# EAGLE schematic 7segement4digits1badidea-mk-1 (EAGLE 6.5.0)
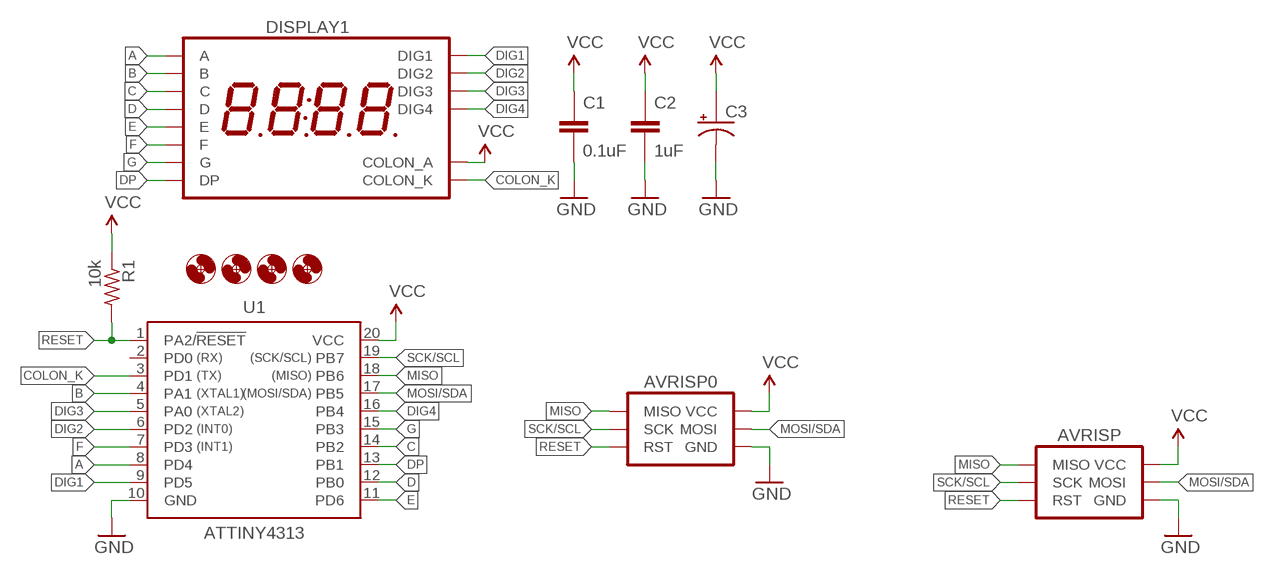
[diagram p0: schematic, sheet 1]

## Parts
AVRISP  AVR_SPI_PRG_6PTH  [2X3]
AVRISP0  AVR_SPI_PRG_6AVR-JST-PTH-RA-I2C  [AVR-JST-6-PTH-RA-I2C]
C1  0.1uF  CAPACITOR-CERAMIC025-024X044  [C025-024X044]
C2  1uF  CAPACITOR-CERAMIC025-024X044  [C025-024X044]
C3  CAPACITOR-POLARIZEDE2-4  [E2-4]
DISPLAY1  7SED_4DIGIT_14MM14.2MM-CC  [7SEG_4DIG]
H1  HOLE#2  [HOLE-#2]
H2  HOLE#2  [HOLE-#2]
H3  HOLE#2  [HOLE-#2]
H4  HOLE#2  [HOLE-#2]
R1  10k  RESISTORPTH-AXIAL-7.68MM  [RESISTOR-AXIAL-PTH-7.68MM]
U1  ATTINY4313  ATTINY2313ADIP  [DIL20]

## Nets
A: DISPLAY1.P$13(A) U1.8(PD4)
B: DISPLAY1.P$9(B) U1.4(PA1)
C: DISPLAY1.P$4(C) U1.14(PB2)
COLON_K: DISPLAY1.P$7(COLON_K) U1.3(PD1)
D: DISPLAY1.P$2(D) U1.12(PB0)
DIG1: DISPLAY1.P$14(DIG1) U1.9(PD5)
DIG2: DISPLAY1.P$11(DIG2) U1.6(PD2)
DIG3: DISPLAY1.P$10(DIG3) U1.5(PA0)
DIG4: DISPLAY1.P$6(DIG4) U1.16(PB4)
DP: DISPLAY1.P$3(DP) U1.13(PB1)
E: DISPLAY1.P$1(E) U1.11(PD6)
F: DISPLAY1.P$12(F) U1.7(PD3)
G: DISPLAY1.P$5(G) U1.15(PB3)
GND: AVRISP0.GND AVRISP.6(GND) C1.2 C2.2 C3.- U1.10(GND)
MISO: AVRISP0.MISO AVRISP.1(MISO) U1.18(PB6)
MOSI/SDA: AVRISP0.MOSI/SDA(MOSI) AVRISP.4(MOSI) U1.17(PB5)
RESET: AVRISP0.RESET(RST) AVRISP.5(RST) R1.P$2 U1.1(PA2/!RESET)
SCK/SCL: AVRISP0.SCK AVRISP.3(SCK) U1.19(PB7)
VCC: AVRISP0.VCC AVRISP.2(VCC) C1.1 C2.1 C3.+ DISPLAY1.P$8(COLON_A) R1.P$1 U1.20(VCC)
Unconnected: U1.2(PD0)

## Library data of the parts
AVRISP AVRISP0 = A_butts:AVR_SPI_PRG_6: AVR ISP 6 Pin This is the reduced ISP connector for AVR programming. Common on Arduino. This footprint will take up less PCB space and can be used with a 10-pin to 6-pin adapter such as SKU: BOB-08508 **Special note about "TEST_POINT" package. The stop mask is on the top side, so if you want your programming test points to be on the bottom of your board, make sure to place this package on the bottom side of the board. This also ensure that the orientation to program from the bottom side will be correct.
C1 C2 = A_butts:CAPACITOR-CERAMIC: CAPACITOR, European symbol
C3 = A_butts:CAPACITOR-POLARIZED: POLARIZED CAPACITOR, American symbol
DISPLAY1 = A_butts:7SED_4DIGIT_14MM
H1-H4 = A_butts:HOLE: MOUNTING HOLE with drill center marker
R1 = A_butts:RESISTOR: RESISTOR, American symbol
U1 = A_butts:ATTINY2313A: ATTINY2313A 2kB 20MHz I2C/SPI/UART